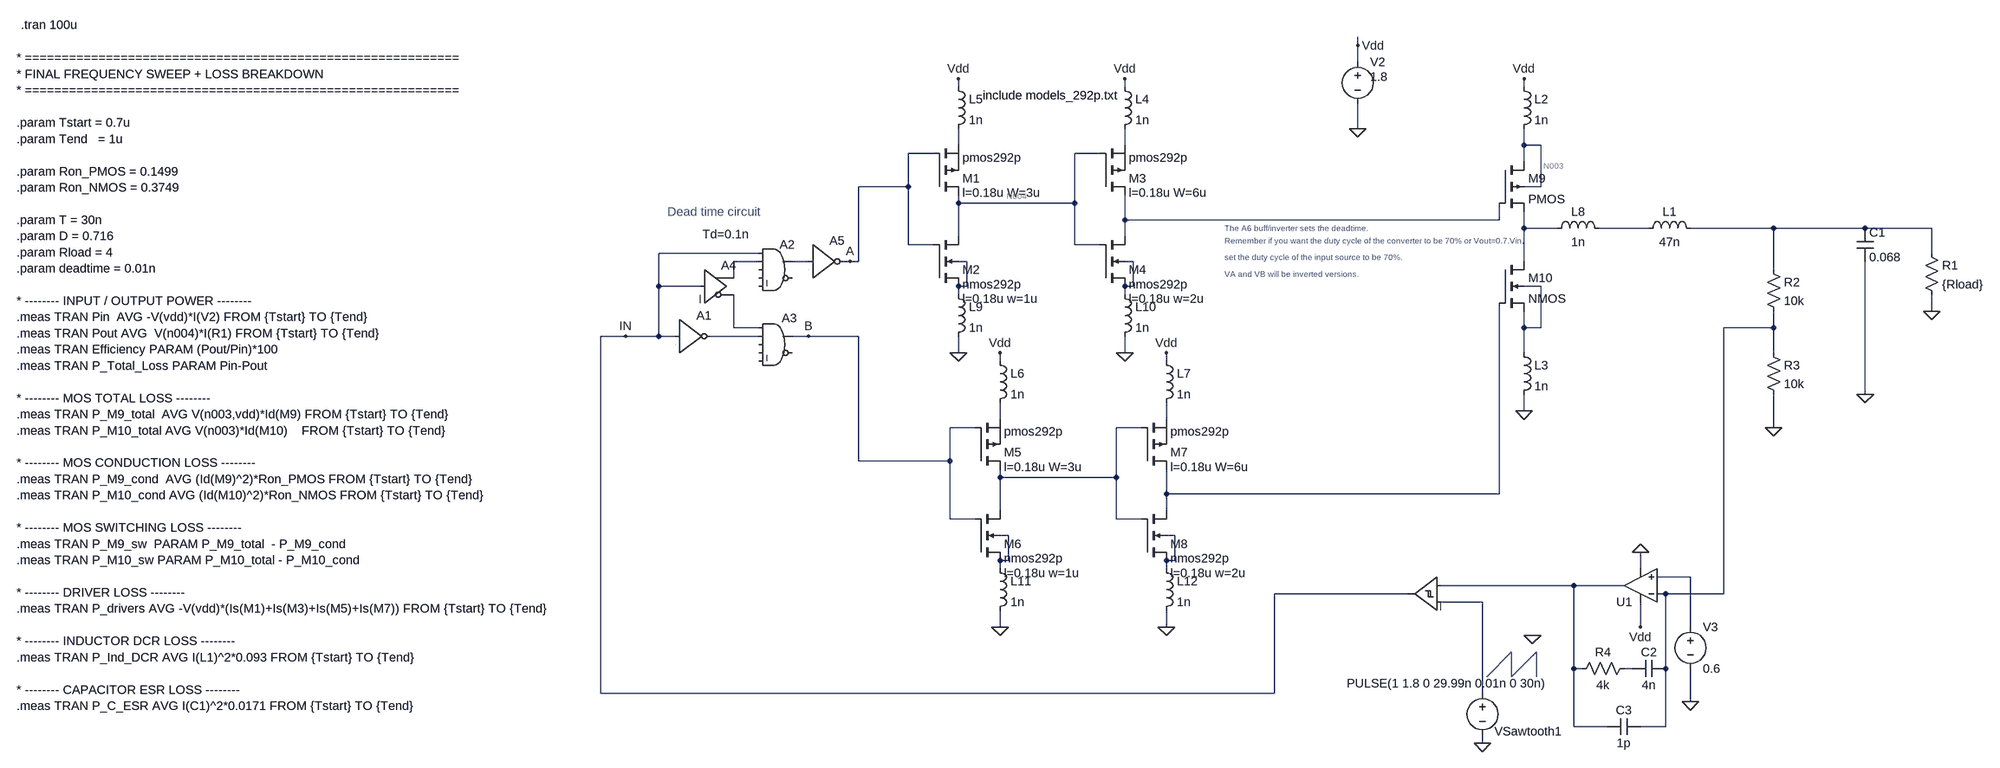
[diagram p0: schematic my_own_buck_converter.asc]
my_own_buck_converter.asc, the LTspice schematic file:
Version 4.1
SHEET 1 996 1172
WIRE -368 -288 -368 -304
WIRE -368 -256 -368 -288
WIRE -1136 -208 -1136 -224
WIRE -816 -208 -816 -224
WIRE -48 -208 -48 -224
WIRE -368 -128 -368 -176
WIRE -1136 -96 -1136 -128
WIRE -816 -96 -816 -128
WIRE -48 -96 -48 -128
WIRE -16 -96 -48 -96
WIRE -1184 -80 -1232 -80
WIRE -864 -80 -912 -80
WIRE -48 -64 -48 -96
WIRE -1232 -16 -1232 -80
WIRE -1232 -16 -1328 -16
WIRE -16 -16 -16 -96
WIRE -16 -16 -48 -16
WIRE -1136 16 -1136 0
WIRE -912 16 -912 -80
WIRE -912 16 -1136 16
WIRE -816 48 -816 0
WIRE -96 48 -96 16
WIRE -96 48 -816 48
WIRE -48 64 -48 32
WIRE 16 64 -48 64
WIRE 192 64 96 64
WIRE 432 64 272 64
WIRE 608 64 432 64
WIRE 736 64 608 64
WIRE -1136 80 -1136 16
WIRE -816 80 -816 48
WIRE -1232 96 -1232 -16
WIRE -1184 96 -1232 96
WIRE -912 96 -912 16
WIRE -864 96 -912 96
WIRE -1520 112 -1712 112
WIRE 736 112 736 64
WIRE -1520 128 -1568 128
WIRE -1424 128 -1456 128
WIRE -1344 128 -1360 128
WIRE -1328 128 -1328 -16
WIRE -1328 128 -1344 128
WIRE -1120 128 -1136 128
WIRE -800 128 -816 128
WIRE -48 128 -48 64
WIRE 432 144 432 64
WIRE -1568 160 -1568 128
WIRE -1712 176 -1712 112
WIRE -1632 176 -1712 176
WIRE -1120 176 -1120 128
WIRE -1120 176 -1136 176
WIRE -800 176 -800 128
WIRE -800 176 -816 176
WIRE -16 176 -48 176
WIRE -1136 192 -1136 176
WIRE -816 192 -816 176
WIRE 736 224 736 192
WIRE -1568 256 -1568 192
WIRE -1520 256 -1568 256
WIRE -48 256 -48 224
WIRE -16 256 -16 176
WIRE -16 256 -48 256
WIRE 432 256 432 224
WIRE 432 256 336 256
WIRE -1776 272 -1824 272
WIRE -1712 272 -1712 176
WIRE -1712 272 -1776 272
WIRE -1680 272 -1712 272
WIRE -1520 272 -1616 272
WIRE -1424 272 -1456 272
WIRE -1328 272 -1424 272
WIRE -1136 304 -1136 272
WIRE -816 304 -816 272
WIRE -48 304 -48 256
WIRE 432 304 432 256
WIRE -1056 320 -1056 304
WIRE -736 320 -736 304
WIRE 608 384 608 128
WIRE -48 416 -48 384
WIRE -1056 432 -1056 400
WIRE -736 432 -736 400
WIRE -1104 448 -1152 448
WIRE -784 448 -832 448
WIRE 432 448 432 384
WIRE -1328 512 -1328 272
WIRE -1152 512 -1152 448
WIRE -1152 512 -1328 512
WIRE -1056 544 -1056 528
WIRE -832 544 -832 448
WIRE -832 544 -1056 544
WIRE -736 576 -736 528
WIRE -96 576 -96 208
WIRE -96 576 -736 576
WIRE -1056 608 -1056 544
WIRE -736 608 -736 576
WIRE -1152 624 -1152 512
WIRE -1104 624 -1152 624
WIRE -832 624 -832 544
WIRE -784 624 -832 624
WIRE -1040 656 -1056 656
WIRE -720 656 -736 656
WIRE -1040 704 -1040 656
WIRE -1040 704 -1056 704
WIRE -720 704 -720 656
WIRE -720 704 -736 704
WIRE -1056 720 -1056 704
WIRE -736 720 -736 704
WIRE 176 720 176 688
WIRE 272 736 208 736
WIRE 48 752 -208 752
WIRE 144 752 48 752
WIRE -272 768 -528 768
WIRE 224 768 208 768
WIRE 336 768 336 256
WIRE 336 768 224 768
WIRE -128 784 -208 784
WIRE -1056 832 -1056 800
WIRE -736 832 -736 800
WIRE 176 832 176 784
WIRE 272 832 272 736
WIRE 48 912 48 752
WIRE 64 912 48 912
WIRE 160 912 144 912
WIRE 224 912 224 768
WIRE -1824 960 -1824 272
WIRE -528 960 -528 768
WIRE -528 960 -1824 960
WIRE -128 960 -128 784
WIRE 272 976 272 912
WIRE 48 1024 48 912
WIRE 112 1024 48 1024
WIRE 224 1024 224 912
WIRE 224 1024 176 1024
WIRE -128 1056 -128 1040
FLAG -1344 128 A
FLAG -1424 272 B
FLAG -1776 272 IN
FLAG -368 -128 0
FLAG -368 -288 Vdd
FLAG -48 -224 Vdd
FLAG 608 384 0
FLAG 736 224 0
FLAG -816 -224 Vdd
FLAG -1136 -224 Vdd
FLAG -1056 304 Vdd
FLAG -736 304 Vdd
FLAG -48 416 0
FLAG -1136 304 0
FLAG -816 304 0
FLAG -1056 832 0
FLAG -736 832 0
FLAG 432 448 0
FLAG 176 832 Vdd
FLAG 176 688 0
FLAG 272 976 0
FLAG -128 1056 0
FLAG -32 848 0
SYMBOL Digital\\inv -1680 208 R0
WINDOW 3 0 0 Invisible 2
SYMATTR Value Vhigh=1.8 Td=0.01n
SYMATTR InstName A1
SYMBOL Digital\\and -1488 80 R0
WINDOW 3 -70 -9 Invisible 2
SYMATTR Value Vhigh=1.8
SYMATTR InstName A2
SYMATTR Value2 tripdt=20n
SYMBOL Digital\\and -1488 224 R0
WINDOW 0 12 13 Left 2
WINDOW 3 -54 132 Invisible 2
SYMATTR InstName A3
SYMATTR Value Vhigh=1.8
SYMATTR Value2 tripdt=20n
SYMBOL Digital\\buf -1632 112 R0
WINDOW 3 4 -36 Left 2
SYMATTR Value Td=0.1n
SYMATTR InstName A4
SYMATTR Value2 Vhigh=1.8
SYMBOL Digital\\inv -1424 64 R0
WINDOW 3 0 0 Invisible 2
SYMATTR Value Vhigh=1.8 Td=0.01n
SYMATTR InstName A5
SYMBOL pmos -1184 0 M180
WINDOW 39 56 4 Left 2
SYMATTR SpiceLine l=0.18u W=3u
SYMATTR InstName M1
SYMATTR Value pmos292p
SYMBOL nmos4 -1184 176 M180
WINDOW 3 56 4 Left 2
WINDOW 123 56 -24 Left 2
SYMATTR Value nmos292p
SYMATTR Value2 l=0.18u w=1u
SYMATTR InstName M2
SYMBOL pmos -864 0 M180
WINDOW 39 56 4 Left 2
SYMATTR SpiceLine l=0.18u W=6u
SYMATTR InstName M3
SYMATTR Value pmos292p
SYMBOL nmos4 -864 176 M180
WINDOW 3 56 4 Left 2
WINDOW 123 56 -24 Left 2
SYMATTR Value nmos292p
SYMATTR Value2 l=0.18u w=2u
SYMATTR InstName M4
SYMBOL voltage -368 -272 R0
WINDOW 3 24 44 Left 2
WINDOW 123 0 0 Left 2
WINDOW 39 0 0 Left 2
SYMATTR Value 1.8
SYMATTR InstName V2
SYMBOL pmos -1104 528 M180
WINDOW 39 56 4 Left 2
SYMATTR SpiceLine l=0.18u W=3u
SYMATTR InstName M5
SYMATTR Value pmos292p
SYMBOL nmos4 -1104 704 M180
WINDOW 3 56 4 Left 2
WINDOW 123 56 -24 Left 2
SYMATTR Value nmos292p
SYMATTR Value2 l=0.18u w=1u
SYMATTR InstName M6
SYMBOL pmos -784 528 M180
WINDOW 39 56 4 Left 2
SYMATTR SpiceLine l=0.18u W=6u
SYMATTR InstName M7
SYMATTR Value pmos292p
SYMBOL nmos4 -784 704 M180
WINDOW 3 56 4 Left 2
WINDOW 123 56 -24 Left 2
SYMATTR Value nmos292p
SYMATTR Value2 l=0.18u w=2u
SYMATTR InstName M8
SYMBOL cap 592 64 R0
SYMATTR InstName C1
SYMATTR Value 0.068 
SYMATTR SpiceLine V=25 Irms=0 Rser=0.0171 Lser=307p mfg="W rth Elektronik" pn="885012206070 WCAP-CSGP 0603" type="X7R"
SYMBOL pmos4 -96 -64 R0
SYMATTR InstName M9
SYMATTR Value2 l=180n w=40000u
SYMBOL nmos4 -96 128 R0
SYMATTR InstName M10
SYMATTR Value2 l=180n w=20000u
SYMBOL ind 176 80 R270
WINDOW 0 32 56 VTop 2
WINDOW 3 5 56 VBottom 2
SYMATTR InstName L1
SYMATTR Value 47n
SYMATTR SpiceLine Ipk=1 Rser=0.093 Rpar=70367.7 Cpar=0 mfg="Coilcraft" pn="0805HP-47N"
SYMBOL res 720 96 R0
SYMATTR InstName R1
SYMATTR Value {Rload}
SYMBOL ind -64 -224 R0
SYMATTR InstName L2
SYMATTR Value 1n
SYMATTR SpiceLine Rser=0
SYMBOL ind -64 288 R0
SYMATTR InstName L3
SYMATTR Value 1n
SYMATTR SpiceLine Rser=0
SYMBOL ind -832 -224 R0
SYMATTR InstName L4
SYMATTR Value 1n
SYMATTR SpiceLine Rser=0
SYMBOL ind -1152 -224 R0
SYMATTR InstName L5
SYMATTR Value 1n
SYMATTR SpiceLine Rser=0
SYMBOL ind -1072 304 R0
SYMATTR InstName L6
SYMATTR Value 1n
SYMATTR SpiceLine Rser=0
SYMBOL ind -752 304 R0
SYMATTR InstName L7
SYMATTR Value 1n
SYMATTR SpiceLine Rser=0
SYMBOL ind 0 80 R270
WINDOW 0 32 56 VTop 2
WINDOW 3 5 56 VBottom 2
SYMATTR InstName L8
SYMATTR Value 1n
SYMATTR SpiceLine Rser=0
SYMBOL ind -1152 176 R0
SYMATTR InstName L9
SYMATTR Value 1n
SYMATTR SpiceLine Rser=0
SYMBOL ind -832 176 R0
SYMATTR InstName L10
SYMATTR Value 1n
SYMATTR SpiceLine Rser=0
SYMBOL ind -1072 704 R0
SYMATTR InstName L11
SYMATTR Value 1n
SYMATTR SpiceLine Rser=0
SYMBOL ind -752 704 R0
SYMATTR InstName L12
SYMATTR Value 1n
SYMATTR SpiceLine Rser=0
SYMBOL res 416 128 R0
SYMATTR InstName R2
SYMATTR Value 10k
SYMBOL res 416 288 R0
SYMATTR InstName R3
SYMATTR Value 10k
SYMBOL OpAmps\\UniversalOpAmp2 176 752 R180
SYMATTR InstName U1
SYMATTR Value2 Avol=100 GBW=35Meg Slew=35Meg
SYMBOL voltage 272 816 R0
WINDOW 123 0 0 Left 0
WINDOW 39 0 0 Left 0
SYMATTR InstName V3
SYMATTR Value 0.6
SYMBOL res 160 896 R90
WINDOW 0 0 56 VBottom 2
WINDOW 3 32 56 VTop 2
SYMATTR InstName R4
SYMATTR Value 4k
SYMBOL cap 224 896 R90
WINDOW 0 0 32 VBottom 2
WINDOW 3 32 32 VTop 2
SYMATTR InstName C2
SYMATTR Value 4n
SYMBOL cap 176 1008 R90
WINDOW 0 0 32 VBottom 2
WINDOW 3 32 32 VTop 2
SYMATTR InstName C3
SYMATTR Value 1p
SYMBOL voltage -128 944 R0
WINDOW 123 0 0 Left 2
WINDOW 39 0 0 Left 2
WINDOW 3 -261 -3 Left 2
WINDOW 0 23 89 Left 2
SYMATTR Value PULSE(1 1.8 0 29.99n 0.01n 0 30n)
SYMATTR InstName VSawtooth1
SYMBOL Digital\\diffschmtbuf -208 704 M0
WINDOW 3 26 94 Invisible 2
WINDOW 0 8 16 Invisible 2
SYMATTR Value Vt=0 Vh=0
SYMATTR InstName A7
SYMATTR SpiceLine Trise=10n
SYMATTR SpiceLine2 tripdt=2n
SYMATTR Value2 Vlow=-1
TEXT -2976 -328 Left 2 !.tran 100u
TEXT -1696 32 Left 2 ;Dead time circuit
TEXT -624 64 Left 1 ;The A6 buff/inverter sets the deadtime.
TEXT -624 88 Left 1 ;Remember if you want the duty cycle of the converter to be 70% or Vout=0.7.Vin,
TEXT -624 152 Left 1 ;VA and VB will be inverted versions.
TEXT -624 120 Left 1 ;set the duty cycle of the input source to be 70%.
TEXT -1096 -192 Left 2 !.include models_292p.txt
TEXT -2984 -264 Left 2 !* ===========================================================\n* FINAL FREQUENCY SWEEP + LOSS BREAKDOWN\n* ===========================================================\n \n.param Tstart = 0.7u\n.param Tend   = 1u\n \n.param Ron_PMOS = 0.1499\n.param Ron_NMOS = 0.3749\n \n.param T = 30n\n.param D = 0.716\n.param Rload = 4\n.param deadtime = 0.01n\n \n* -------- INPUT / OUTPUT POWER --------\n.meas TRAN Pin  AVG -V(vdd)*I(V2) FROM {Tstart} TO {Tend}\n.meas TRAN Pout AVG  V(n004)*I(R1) FROM {Tstart} TO {Tend}\n.meas TRAN Efficiency PARAM (Pout/Pin)*100\n.meas TRAN P_Total_Loss PARAM Pin-Pout\n \n* -------- MOS TOTAL LOSS --------\n.meas TRAN P_M9_total  AVG V(n003,vdd)*Id(M9) FROM {Tstart} TO {Tend}\n.meas TRAN P_M10_total AVG V(n003)*Id(M10)    FROM {Tstart} TO {Tend}\n \n* -------- MOS CONDUCTION LOSS --------\n.meas TRAN P_M9_cond  AVG (Id(M9)^2)*Ron_PMOS FROM {Tstart} TO {Tend}\n.meas TRAN P_M10_cond AVG (Id(M10)^2)*Ron_NMOS FROM {Tstart} TO {Tend}\n \n* -------- MOS SWITCHING LOSS --------\n.meas TRAN P_M9_sw  PARAM P_M9_total  - P_M9_cond\n.meas TRAN P_M10_sw PARAM P_M10_total - P_M10_cond\n \n* -------- DRIVER LOSS --------\n.meas TRAN P_drivers AVG -V(vdd)*(Is(M1)+Is(M3)+Is(M5)+Is(M7)) FROM {Tstart} TO {Tend}\n \n* -------- INDUCTOR DCR LOSS --------\n.meas TRAN P_Ind_DCR AVG I(L1)^2*0.093 FROM {Tstart} TO {Tend}\n \n* -------- CAPACITOR ESR LOSS --------\n.meas TRAN P_C_ESR AVG I(C1)^2*0.0171 FROM {Tstart} TO {Tend}
LINE Normal -72 880 -120 928
LINE Normal -72 928 -72 880
LINE Normal -24 880 -72 928
LINE Normal -24 928 -24 880

The netlist it stands for:
* my_own_buck_converter.asc
A1 IN 0 0 0 0 N016 0 0 BUF Vhigh=1.8 Td=0.01n
A2 IN N009 0 0 0 0 N010 0 AND Vhigh=1.8 tripdt=20n
A3 N014 N016 0 0 0 0 B 0 AND Vhigh=1.8 tripdt=20n
A4 IN 0 0 0 0 N014 N009 0 BUF Td=0.1n Vhigh=1.8
A5 N010 0 0 0 0 A 0 0 BUF Vhigh=1.8 Td=0.01n
M1 N004 A N001 N001 pmos292p l=0.18u W=3u
M2 N011 A N004 N011 nmos292p l=0.18u w=1u
M3 N005 N004 N002 N002 pmos292p l=0.18u W=6u
M4 N012 N004 N005 N012 nmos292p l=0.18u w=2u
V2 Vdd 0 1.8
M5 N019 B N017 N017 pmos292p l=0.18u W=3u
M6 N021 B N019 N021 nmos292p l=0.18u w=1u
M7 N020 N019 N018 N018 pmos292p l=0.18u W=6u
M8 N022 N019 N020 N022 nmos292p l=0.18u w=2u
C1 N008 0 0.068 V=25 Irms=0 Rser=0.0171 Lser=307p mfg="W rth Elektronik" pn="885012206070 WCAP-CSGP 0603" type="X7R"
M9 N003 N005 N006 N003 PMOS l=180n w=40000u
M10 N006 N020 N013 N013 NMOS l=180n w=20000u
L1 N007 N008 47n Ipk=1 Rser=0.093 Rpar=70367.7 Cpar=0 mfg="Coilcraft" pn="0805HP-47N"
R1 N008 0 {Rload}
L2 Vdd N003 1n Rser=0
L3 N013 0 1n Rser=0
L4 Vdd N002 1n Rser=0
L5 Vdd N001 1n Rser=0
L6 Vdd N017 1n Rser=0
L7 Vdd N018 1n Rser=0
L8 N006 N007 1n Rser=0
L9 N011 0 1n Rser=0
L10 N012 0 1n Rser=0
L11 N021 0 1n Rser=0
L12 N022 0 1n Rser=0
R2 N008 N015 10k
R3 N015 0 10k
X§U1 N023 N015 Vdd 0 N024 level2 Avol=100 GBW=35Meg Slew=35Meg Ilimit=25m Rail=0 Vos=0 En=0 Enk=0 In=0 Ink=0 Rin=500Meg  ; pins In+ In- V+ V- OUT
V3 N023 0 0.6
R4 N026 N024 4k
C2 N015 N026 4n
C3 N015 N024 1p
VSawtooth1 N025 0 PULSE(1 1.8 0 29.99n 0.01n 0 30n)
A7 N024 N025 0 0 0 0 IN 0 SCHMITT Vt=0 Vh=0 Vlow=-1 Trise=10n tripdt=2n
.model NMOS NMOS
.model PMOS PMOS
.lib standard.mos
.tran 100u
* Dead time circuit
* The A6 buff/inverter sets the deadtime.
* Remember if you want the duty cycle of the converter to be 70% or Vout=0.7.Vin,
* VA and VB will be inverted versions.
* set the duty cycle of the input source to be 70%.
.include models_292p.txt
* ===========================================================
* FINAL FREQUENCY SWEEP + LOSS BREAKDOWN
* ===========================================================
.param Tstart = 0.7u
.param Tend   = 1u
.param Ron_PMOS = 0.1499
.param Ron_NMOS = 0.3749
.param T = 30n
.param D = 0.716
.param Rload = 4
.param deadtime = 0.01n
* -------- INPUT / OUTPUT POWER --------
.meas TRAN Pin  AVG -V(vdd)*I(V2) FROM {Tstart} TO {Tend}
.meas TRAN Pout AVG  V(n004)*I(R1) FROM {Tstart} TO {Tend}
.meas TRAN Efficiency PARAM (Pout/Pin)*100
.meas TRAN P_Total_Loss PARAM Pin-Pout
* -------- MOS TOTAL LOSS --------
.meas TRAN P_M9_total  AVG V(n003,vdd)*Id(M9) FROM {Tstart} TO {Tend}
.meas TRAN P_M10_total AVG V(n003)*Id(M10)    FROM {Tstart} TO {Tend}
* -------- MOS CONDUCTION LOSS --------
.meas TRAN P_M9_cond  AVG (Id(M9)^2)*Ron_PMOS FROM {Tstart} TO {Tend}
.meas TRAN P_M10_cond AVG (Id(M10)^2)*Ron_NMOS FROM {Tstart} TO {Tend}
* -------- MOS SWITCHING LOSS --------
.meas TRAN P_M9_sw  PARAM P_M9_total  - P_M9_cond
.meas TRAN P_M10_sw PARAM P_M10_total - P_M10_cond
* -------- DRIVER LOSS --------
.meas TRAN P_drivers AVG -V(vdd)*(Is(M1)+Is(M3)+Is(M5)+Is(M7)) FROM {Tstart} TO {Tend}
* -------- INDUCTOR DCR LOSS --------
.meas TRAN P_Ind_DCR AVG I(L1)^2*0.093 FROM {Tstart} TO {Tend}
* -------- CAPACITOR ESR LOSS --------
.meas TRAN P_C_ESR AVG I(C1)^2*0.0171 FROM {Tstart} TO {Tend}
.lib UniversalOpAmp2.lib
.backanno
.end